# EAGLE design ArduinoRgbFanController (EAGLE 7.4.0)
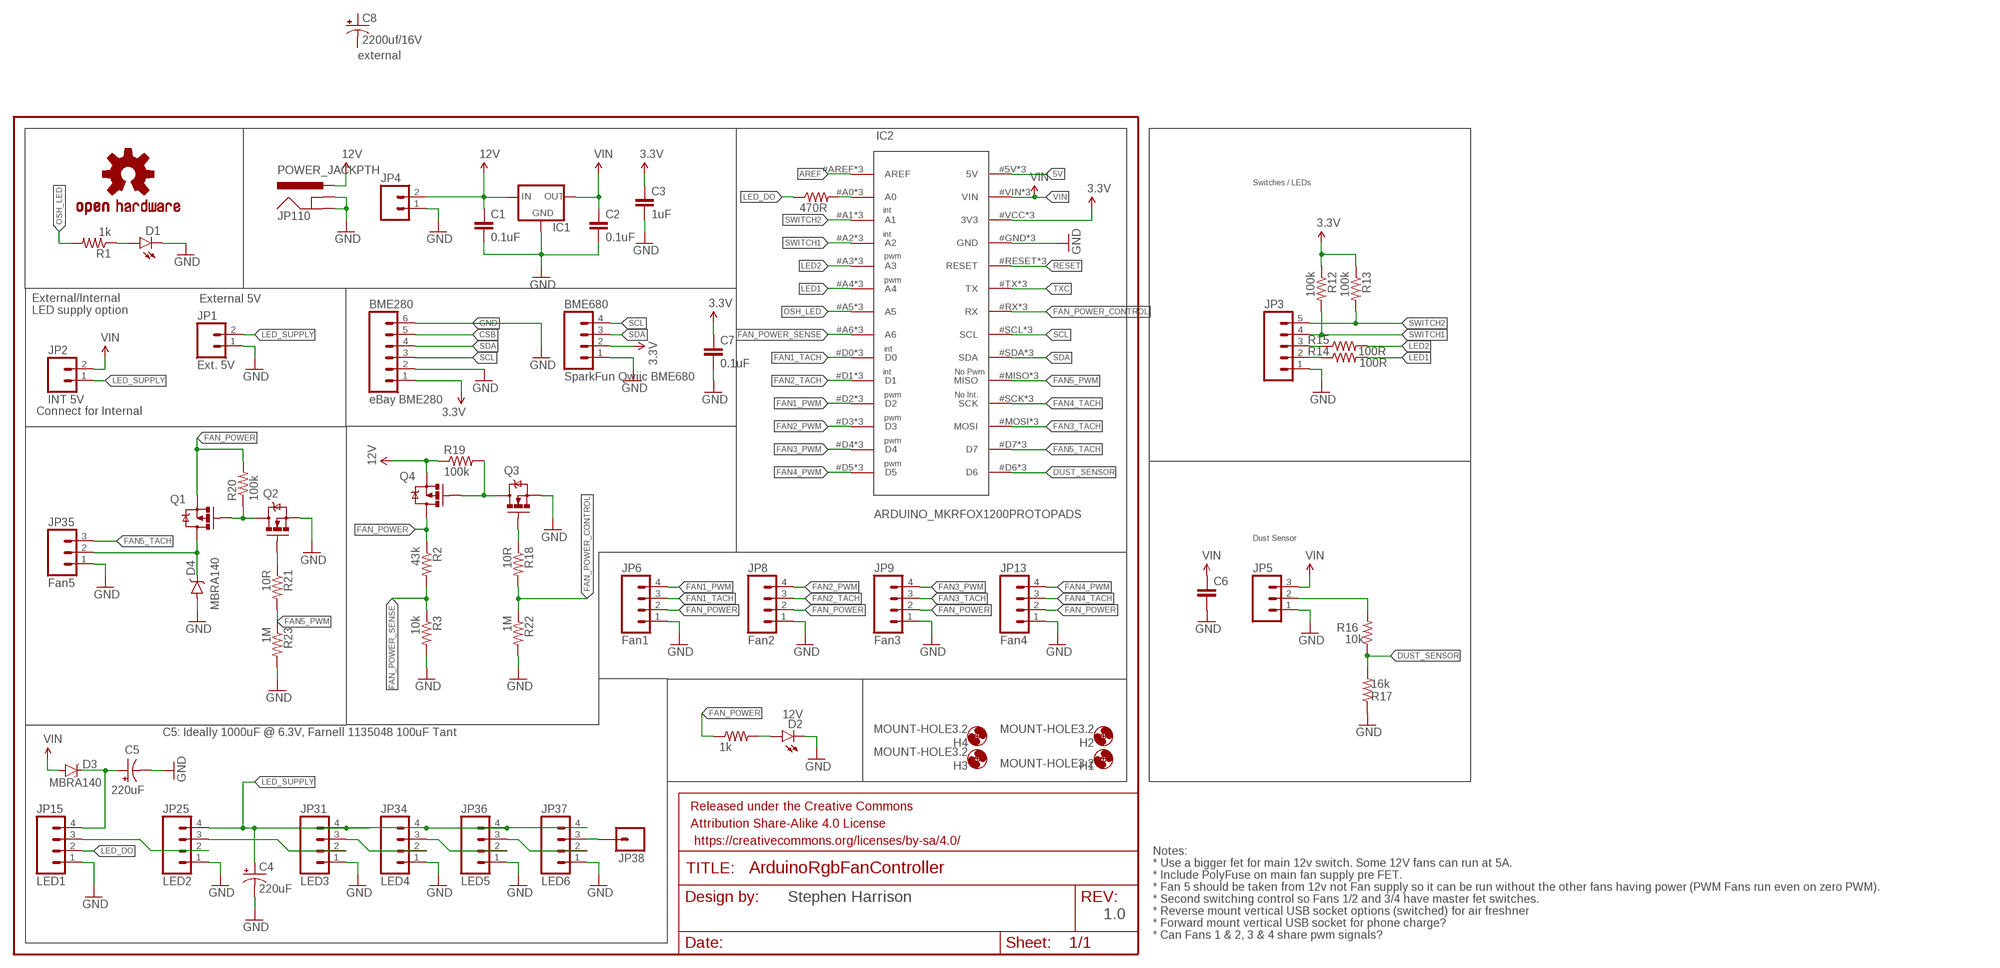
[diagram p0: schematic, sheet 1]

## Parts
BME280  eBay BME280  M06SILK_FEMALE_PTH  [1X06]
BME680  SparkFun Qwiic BME680  M04PTH  [1X04]
C1  0.1uF  1UF-25V-10%(0805)"  [0805-CAP]
C2  0.1uF  1UF-25V-10%(0805)"  [0805-CAP]
C3  1uF  1UF-25V-10%(0805)"  [0805-CAP]
C4  220uF  47UF-10V-10%(TANT)  [EIA3528]
C5  220uF  47UF-10V-10%(TANT)  [EIA3528]
C6  1UF-25V-10%(0805)"  [0805-CAP]
C7  0.1uF  1UF-25V-10%(0805)"  [0805-CAP]
C8  2200uf/16V  1000UF-25V(PTH)KIT  [CPOL-RADIAL-1000UF-25V-KIT]
D1  LED1206-BOTTOM  [LED-1206-BOTTOM]
D2  12V  LED-RED1206  [LED-1206]
D3  MBRA140  DIODE-SCHOTTKY-MBRA140  [SMA-DIODE]
D4  MBRA140  DIODE-SCHOTTKY-MBRA140  [SMA-DIODE]
FRAME1  FRAME-LETTER  [CREATIVE_COMMONS]
H1  MOUNT-HOLE3.2  [3,2]
H2  MOUNT-HOLE3.2  [3,2]
H3  MOUNT-HOLE3.2  [3,2]
H4  MOUNT-HOLE3.2  [3,2]
IC1  78XXS  [78XXS]
IC2  ARDUINO_MKRFOX1200PROTOPADS  [ARDUINO_MKRFOX1200_PROTOPADS]
JP1  Ext. 5V  M023.5MM  [SCREWTERMINAL-3.5MM-2]
JP2  INT 5V  M02PTH  [1X02]
JP3  M05PTH  [1X05]
JP4  M025MM  [SCREWTERMINAL-5MM-2]
JP5  M03POLAR  [MOLEX-1X3]
JP6  Fan1  M04POLAR  [MOLEX-1X4]
JP8  Fan2  M04POLAR  [MOLEX-1X4]
JP9  Fan3  M04POLAR  [MOLEX-1X4]
JP13  Fan4  M04POLAR  [MOLEX-1X4]
JP15  LED1  M04PTH  [1X04]
JP25  LED2  M04PTH  [1X04]
JP31  LED3  M04PTH  [1X04]
JP34  LED4  M04PTH  [1X04]
JP35  Fan5  M03POLAR  [MOLEX-1X3]
JP36  LED5  M04PTH  [1X04]
JP37  LED6  M04PTH  [1X04]
JP38  M01PTH  [1X01]
JP110  POWER_JACKPTH  [POWER_JACK_PTH]
LOGO3  OSHW-LOGOM  [OSHW-LOGO-M]
Q1  IRLML930  MOSFET-PCHANNEL  [SOT23-3]
Q2  2N7002  MOSFET-NCHANNELAO3404A  [SOT23-3]
Q3  2N7002  MOSFET-NCHANNELAO3404A  [SOT23-3]
Q4  IRLML930  MOSFET-PCHANNEL  [SOT23-3]
R1  1k  RESISTOR0805-RES  [0805]
R2  43k  RESISTOR0805-RES  [0805]
R3  10k  RESISTOR0805-RES  [0805]
R11  470R  RESISTOR0805-RES  [0805]
R12  100k  RESISTOR0805-RES  [0805]
R13  100k  RESISTOR0805-RES  [0805]
R14  100R  RESISTOR0805-RES  [0805]
R15  100R  RESISTOR0805-RES  [0805]
R16  10k  RESISTOR0805-RES  [0805]
R17  16k  RESISTOR0805-RES  [0805]
R18  10R  RESISTOR0805-RES  [0805]
R19  100k  RESISTOR0805-RES  [0805]
R20  100k  RESISTOR0805-RES  [0805]
R21  10R  RESISTOR0805-RES  [0805]
R22  1M  RESISTOR0805-RES  [0805]
R23  1M  RESISTOR0805-RES  [0805]
R28  1k  RESISTOR1206  [1206]

## Nets
3.3V: BME280.1 BME680.2 C3.1 C7.1 IC2.#VCC(3V3) IC2.@VCC(3V3) IC2.VCC(3V3) R12.1 R13.1
5V: IC2.5V IC2.#5V(5V) IC2.@5V(5V)
12V: C1.1 IC1.IN JP4.2 JP110.PWR Q4.2(S) R19.1
AREF: IC2.#AREF(AREF) IC2.@AREF(AREF) IC2.AREF
CSB: BME280.5
DUST_SENSOR: IC2.#D6(D6) IC2.@D6(D6) IC2.D6 R16.1 R17.2
FAN1_PWM: IC2.#D2(D2) IC2.@D2(D2) IC2.D2 JP6.4
FAN1_TACH: IC2.#D0(D0) IC2.@D0(D0) IC2.D0 JP6.3
FAN2_PWM: IC2.#D3(D3) IC2.@D3(D3) IC2.D3 JP8.4
FAN2_TACH: IC2.#D1(D1) IC2.@D1(D1) IC2.D1 JP8.3
FAN3_PWM: IC2.#D4(D4) IC2.@D4(D4) IC2.D4 JP9.4
FAN3_TACH: IC2.#MOSI(MOSI) IC2.@MOSI(MOSI) IC2.MOSI JP9.3
FAN4_PWM: IC2.#D5(D5) IC2.@D5(D5) IC2.D5 JP13.4
FAN4_TACH: IC2.#SCK(SCK) IC2.@SCK(SCK) IC2.SCK JP13.3
FAN5_PWM: IC2.#MISO(MISO) IC2.@MISO(MISO) IC2.MISO R21.2 R23.1
FAN5_TACH: IC2.#D7(D7) IC2.@D7(D7) IC2.D7 JP35.3
FAN_POWER: JP6.2 JP8.2 JP9.2 JP13.2 Q1.2(S) Q4.3(D) R2.1 R20.2 R28.1
FAN_POWER_CONTROL: IC2.#RX(RX) IC2.@RX(RX) IC2.RX R18.2 R22.1
FAN_POWER_SENSE: IC2.#A6(A6) IC2.@A6(A6) IC2.A6 R2.2 R3.1
GND: BME280.2 BME280.6 BME680.1 C1.2 C2.2 C3.2 C4.C(-) C5.C(-) C6.2 C7.2 D1.C D2.C D4.A IC1.GND IC2.#GND(GND) IC2.@GND(GND) IC2.GND JP1.1 JP3.1 JP4.1 JP5.1 JP6.1 JP8.1 JP9.1 JP13.1 JP15.1 JP25.1 JP31.1 JP34.1 JP35.1 JP36.1 JP37.1 JP110.GND JP110.GNDBREAK Q2.2(S) Q3.2(S) R3.2 R17.1 R22.2 R23.2
LED1: IC2.#A4(A4) IC2.@A4(A4) IC2.A4 R14.2
LED2: IC2.#A3(A3) IC2.@A3(A3) IC2.A3 R15.2
LED_DO: JP15.2 R11.1
LED_SUPPLY: C4.A(+) JP1.2 JP2.1 JP25.4 JP31.4 JP34.4 JP36.4 JP37.4
N$1: D1.A R1.1
N$2: IC2.#A0(A0) IC2.@A0(A0) IC2.A0 R11.2
N$3: JP3.2 R14.1
N$4: JP3.3 R15.1
N$5: Q3.3(D) Q4.1(G) R19.2
N$6: Q3.1(G) R18.1
N$7: JP5.2 R16.2
N$12: D4.C JP35.2 Q1.3(D)
N$16: C5.A(+) D3.C JP15.4
N$17: JP25.3 JP31.2
N$18: JP31.3 JP34.2
N$20: JP34.3 JP36.2
N$21: JP36.3 JP37.2
N$24: JP37.3 JP38.1
N$28: Q1.1(G) Q2.3(D) R20.1
N$30: JP15.3 JP25.2
N$32: Q2.1(G) R21.1
N$94: D2.A R28.2
OSH_LED: IC2.#A5(A5) IC2.@A5(A5) IC2.A5 R1.2
RESET: IC2.#RESET(RESET) IC2.@RESET(RESET) IC2.RESET
SCL: BME280.3 BME680.4 IC2.#SCL(SCL) IC2.@SCL(SCL) IC2.SCL
SDA: BME280.4 BME680.3 IC2.#SDA(SDA) IC2.@SDA(SDA) IC2.SDA
SWITCH1: IC2.#A2(A2) IC2.@A2(A2) IC2.A2 JP3.4 R12.2
SWITCH2: IC2.#A1(A1) IC2.@A1(A1) IC2.A1 JP3.5 R13.2
TXC: IC2.#TX(TX) IC2.@TX(TX) IC2.TX
VIN: C2.1 C6.1 D3.A IC1.OUT IC2.#VIN(VIN) IC2.@VIN(VIN) IC2.VIN JP2.2 JP5.3
Unconnected: C8.+ C8.-

## Notes on the sheet
- external
- Switches / LEDs
- int
- int
- pwm
- pwm
- External 5V
- External/Internal 
  LED supply option
- int
- int | No Pwm
- pwm | No Int.
- Connect for Internal
- pwm
- pwm
- pwm
- Dust Sensor
- C5: Ideally 1000uF @ 6.3V, Farnell 1135048 100uF Tant
- Stephen Harrison
- 1.0
- Notes:
  * Use a bigger fet for main 12v switch. Some 12V fans can run at 5A.
  * Include PolyFuse on main fan supply pre FET.
  * Fan 5 should be taken from 12v not Fan supply so it can be run without the other fans having power (PWM Fans run even on zero PWM).
  * Second switching control so Fans 1/2 and 3/4 have master fet switches.
  * Reverse mount vertical USB socket options (switched) for air freshner
  * Forward mount vertical USB socket for phone charge?
  * Can Fans 1 & 2, 3 & 4 share pwm signals?

## Library data of the parts
BME280 = SparkFun-Connectors:M06: Header 6 Standard 6-pin 0.1" header. Use with straight break away headers (SKU : PRT-00116), right angle break away headers (PRT-00553), swiss pins (PRT-00743), machine pins (PRT-00117), and female headers (PRT-00115). Molex polarized connector foot print use with SKU : PRT-08094 with associated crimp pins and housings. NOTES ON THE VARIANTS LOCK and LOCK_LONGPADS... This footprint was designed to help hold the alignment of a through-hole component (i.e. 6-pin header) while soldering it into place. You may notice that each hole has been shifted either up or down by 0.005 of an inch from it's more standard position (which is a perfectly straight line). This slight alteration caused the pins (the squares in the middle) to touch the edges of the holes. Because they are alternating, it causes a "brace" to hold the component in place. 0.005 has proven to be the perfect amount of "off-center" position when using our standard breakaway headers. Although looks a little odd when you look at the bare footprint, once you have a header in there, the alteration is very hard to notice. Also,if you push a header all the way into place, it is covered up entirely on the bottom side. This idea of altering the position of holes to aid alignment will be further integrated into the Sparkfun Library for other footprints. It can help hold any component with 3 or more connection pins.; PROD_ID: CONN-08437
BME680 JP8 JP9 JP13 = SparkFun-Connectors:M04: Header 4 Standard 4-pin 0.1" header. Use with straight break away headers (SKU : PRT-00116), right angle break away headers (PRT-00553), swiss pins (PRT-00743), machine pins (PRT-00117), and female headers (PRT-00115). Molex polarized connector foot print use with SKU : PRT-08231 with associated crimp pins and housings. 1MM SMD Version SKU: PRT-10208
C1-C3 C6 C7 = SparkFun-Capacitors:1UF-25V-10%(0805): CAP-08064
C4 C5 = SparkFun-Capacitors:47UF-10V-10%(TANT): CAP-08310 47uF Tantalum SMT 10V 10% (EIA-3528); FARNELL: 2491486; PROD_ID: CAP-08310; VALUE: 47uF
C8 = SparkFun-Capacitors:1000UF-25V(PTH): CAP-08070; PROD_ID: CAP-09538; VALUE: 1000uf/25V
D1 = SparkFun-LED:LED: LEDs Standard schematic elements and footprints for 5mm, 3mm, 1206, and 0603 sized LEDs. 5mm - Spark Fun Electronics SKU : COM-00529 (and others)
D2 = SparkFun-LED:LED-RED: Assorted Red LEDs LilyPad 1206- DIO-09912 1206- DIO-00809 0603- DIO-00819 "SMART" means more efficient and expensive; PROD_ID: DIO-09912; VALUE: RED
D3 D4 = SparkFun-DiscreteSemi:DIODE-SCHOTTKY: Schottky diodes in SFE's production catalog BAT20J 1A 23V 0.62Vf RB751 120mA 40V 0.37Vf PMEG4005EJ 0.5A 40V 0.42Vf MBRA140 1A 40V 0.5Vf B340A 3A 40V SMA; PROD_ID: DIO-08053
FRAME1 = SparkFun-Aesthetics:FRAME-LETTER: Schematic Frame Standard 8.5x11 US Letter frame
H1-H4 = holes:MOUNT-HOLE: MOUNTING HOLE with drill center marker
IC1 = v-reg:78XXS: VOLTAGE REGULATOR
IC2 = Arduino:ARDUINO_MKRFOX1200
JP1 = SparkFun-Connectors:M02: Standard 2-pin 0.1" header. Use with - straight break away headers ( PRT-00116) - right angle break away headers (PRT-00553) - swiss pins (PRT-00743) - machine pins (PRT-00117) - female headers (PRT-00115) Molex polarized connector foot print use with: PRT-08233 with associated crimp pins and housings. 2.54_SCREWTERM for use with PRT-10571. 3.5mm Screw Terminal footprints for PRT-08084 5mm Screw Terminal footprints for use with PRT-08432; PROD_ID: CONN-08399
JP2 = SparkFun-Connectors:M02: Standard 2-pin 0.1" header. Use with - straight break away headers ( PRT-00116) - right angle break away headers (PRT-00553) - swiss pins (PRT-00743) - machine pins (PRT-00117) - female headers (PRT-00115) Molex polarized connector foot print use with: PRT-08233 with associated crimp pins and housings. 2.54_SCREWTERM for use with PRT-10571. 3.5mm Screw Terminal footprints for PRT-08084 5mm Screw Terminal footprints for use with PRT-08432
JP3 = SparkFun-Connectors:M05: Header 5 Standard 5-pin 0.1" header. Use with straight break away headers (SKU : PRT-00116), right angle break away headers (PRT-00553), swiss pins (PRT-00743), machine pins (PRT-00117), and female headers (PRT-00115). Molex polarized connector foot print use with SKU : PRT-08230 with associated crimp pins and housings.
JP4 = SparkFun-Connectors:M02: Standard 2-pin 0.1" header. Use with - straight break away headers ( PRT-00116) - right angle break away headers (PRT-00553) - swiss pins (PRT-00743) - machine pins (PRT-00117) - female headers (PRT-00115) Molex polarized connector foot print use with: PRT-08233 with associated crimp pins and housings. 2.54_SCREWTERM for use with PRT-10571. 3.5mm Screw Terminal footprints for PRT-08084 5mm Screw Terminal footprints for use with PRT-08432; STOREFRONT_ID: PRT-08432
JP5 JP35 = SparkFun-Connectors:M03: Header 3 Standard 3-pin 0.1" header. Use with straight break away headers (SKU : PRT-00116), right angle break away headers (PRT-00553), swiss pins (PRT-00743), machine pins (PRT-00117), and female headers (PRT-00115). Molex polarized connector foot print use with SKU : PRT-08232 with associated crimp pins and housings.
JP6 = SparkFun-Connectors:M04: Header 4 Standard 4-pin 0.1" header. Use with straight break away headers (SKU : PRT-00116), right angle break away headers (PRT-00553), swiss pins (PRT-00743), machine pins (PRT-00117), and female headers (PRT-00115). Molex polarized connector foot print use with SKU : PRT-08231 with associated crimp pins and housings. 1MM SMD Version SKU: PRT-10208; FARNELL: 2313705; MOLEX: 47053-1000
JP15 JP25 JP31 JP34 JP36 JP37 = SparkFun-Connectors:M04: Header 4 Standard 4-pin 0.1" header. Use with straight break away headers (SKU : PRT-00116), right angle break away headers (PRT-00553), swiss pins (PRT-00743), machine pins (PRT-00117), and female headers (PRT-00115). Molex polarized connector foot print use with SKU : PRT-08231 with associated crimp pins and housings. 1MM SMD Version SKU: PRT-10208; FARNELL: 2063775
JP38 = SparkFun-Connectors:M01: Header 1 Standard 1-pin 0.1" header. Use with straight break away headers (SKU : PRT-00116), right angle break away headers (PRT-00553), swiss pins (PRT-00743), machine pins (PRT-00117), and female headers (PRT-00115).
JP110 = SparkFun-Connectors:POWER_JACK: Power Jack This is the standard 5.5mm barrel jack for power. The PTH is the most common, proven, reliable, footprint. The Slot footprint only works if the mill layer is transmitted to the PCB fab house so be warned. Mating wall wart : TOL-00298 (and others); PROD_ID: CONN-08197
LOGO3 = SparkFun-Aesthetics:OSHW-LOGO: Open Source Hardware Logo This logo indicates the piece of hardware it is found on incorporates a OSHW license and/or adheres to the definition of open source hardware found here: http://freedomdefined.org/OSHW
Q1 Q4 = SparkFun-DiscreteSemi:MOSFET-PCHANNEL: Generic PMOSFET IRLML2244 - TRANS-11153 (SOT-23 -20V -4.3A) (1.Gate 2.Source 3.Drain) FQP27P06 - COM-10349 <http://www.sparkfun.com/products/10349> (TO-220 -60V -27A) (1.Gate 2.Source 3.Drain); FARNELL: 1831089; PROD_ID: TRANS-08285
Q2 Q3 = SparkFun-DiscreteSemi:MOSFET-NCHANNEL: Common NMOSFET Parts MFG P/N Store ID Prod ID FDD8780 TRANS-09984 SI7820DN TRANS-11055 FDS6630A IC-08089 2N7002PW TRANS-11151 FQP30N06L COM-10213 TRANS-10060 BSS123LT1G TRANS-08345 BSS138 TRANS-00830 BS170 2N7000; FARNELL: 1510761; PROD_ID: TRAN-12988
R1-R3 R11-R23 R28 = SparkFun-Resistors:RESISTOR: Resistor Basic schematic elements and footprints for 0603, 1206, and PTH resistors.

## Board
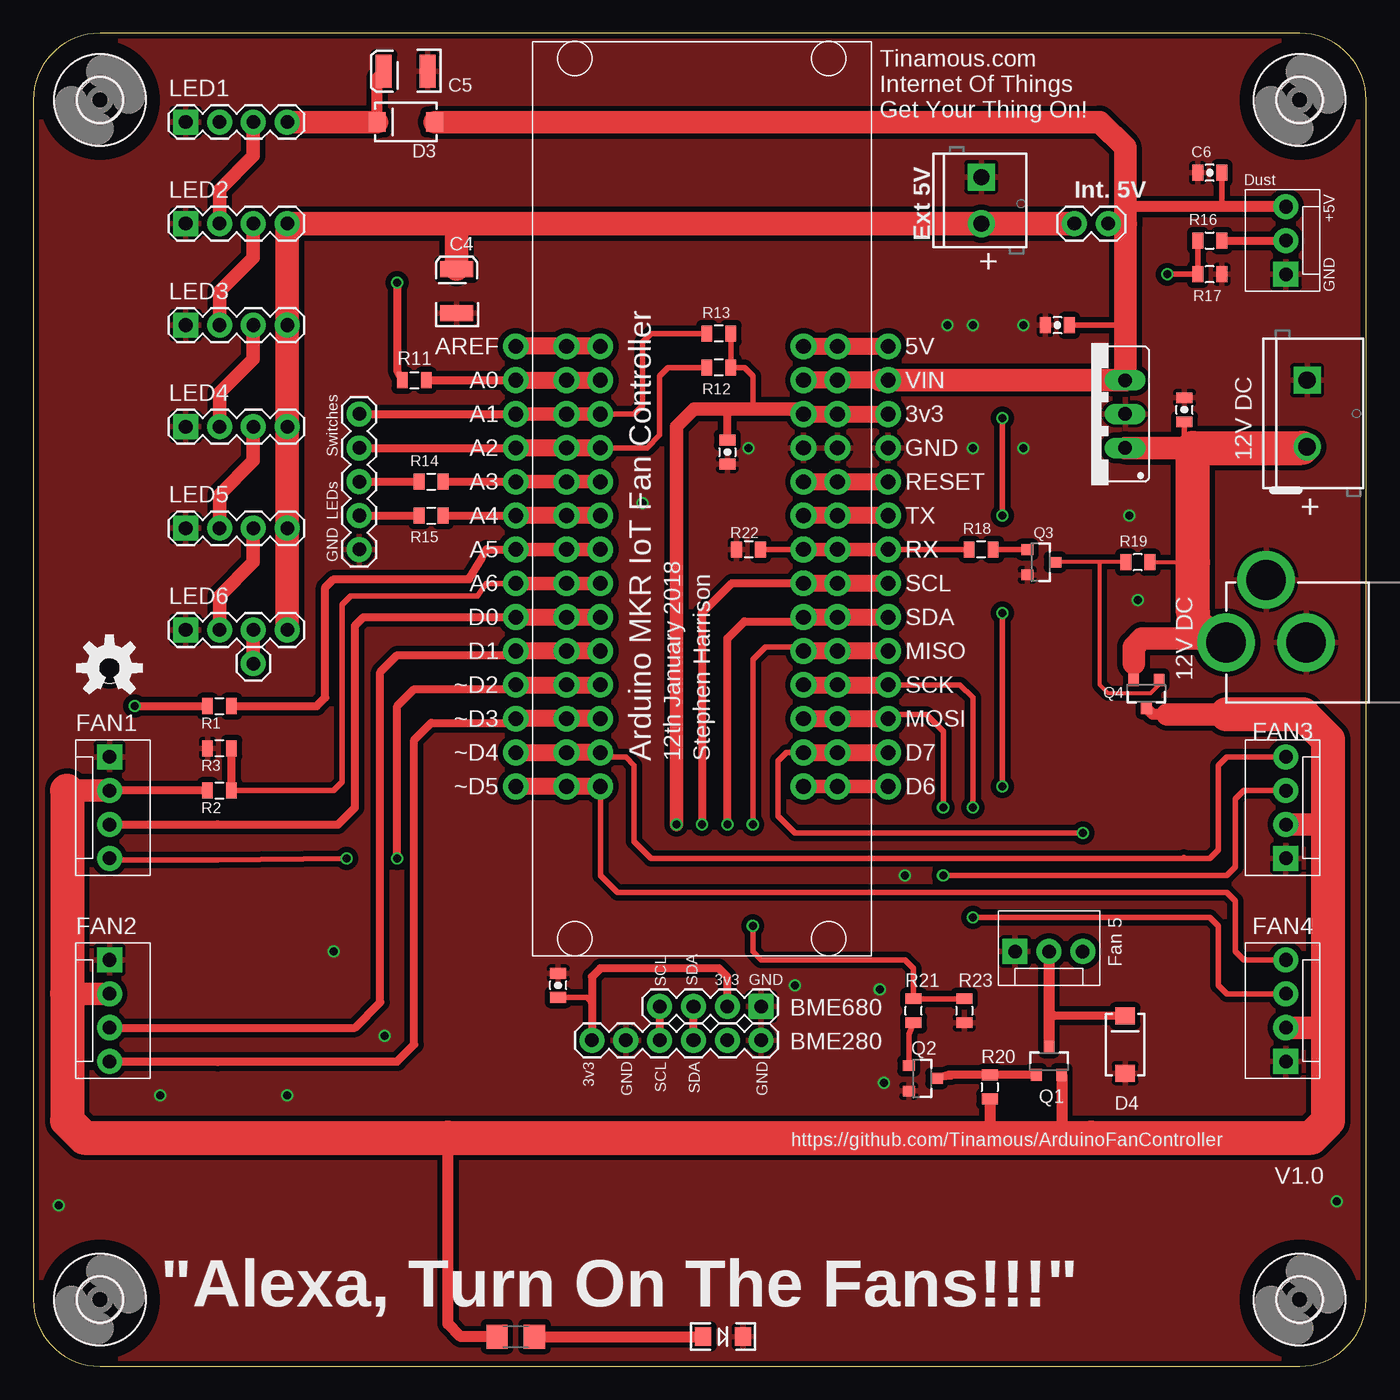
[diagram p1: board, top side]
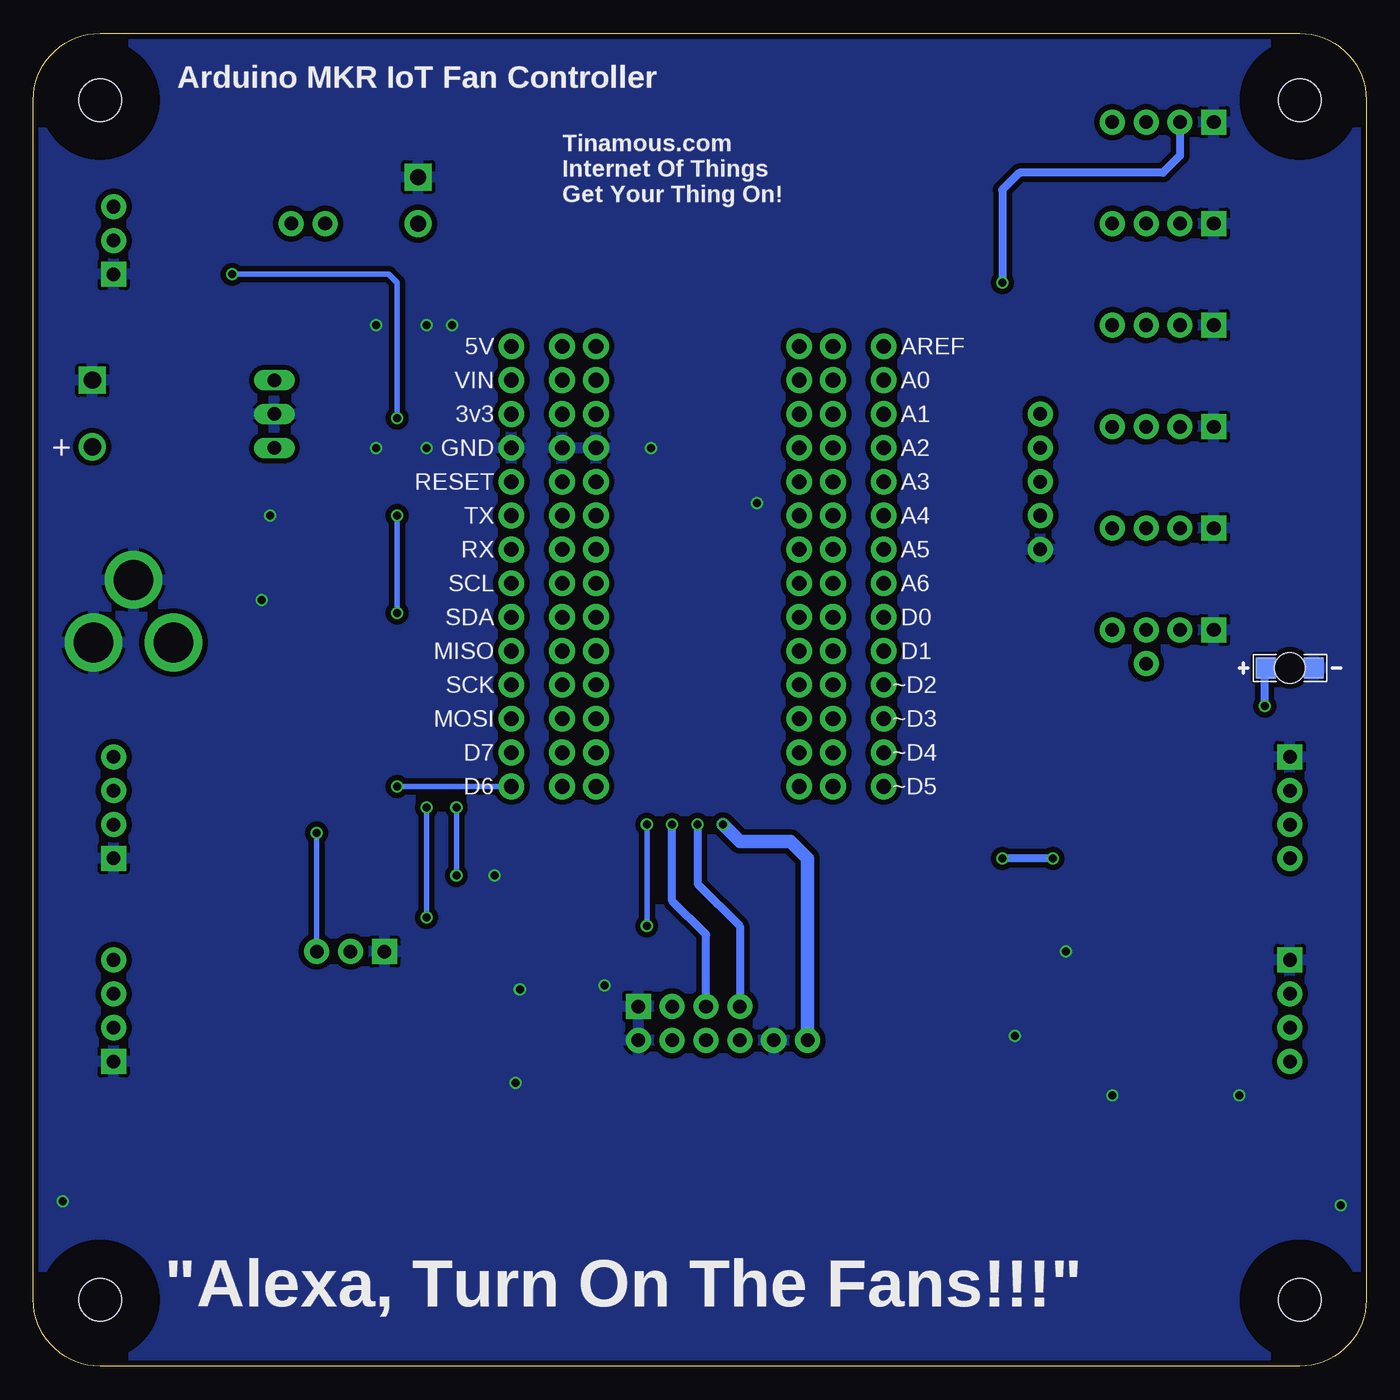
[diagram p2: board, bottom side, seen from below]

Size 100 x 100 mm. Coordinates in mm from the lower left corner, seen from the top.
Outline: 5,0 95,0 arc90 100,5 100,95 arc90 95,100 5,100 arc90 0,95 0,5 arc90 5,0
Copper layers (1*16): Top 0.035mm / dielectric 1.5mm / Bottom 0.035mm
Design rules "dirt_cheap_dirty_boards.v1": minimum track width 5mil, minimum drill 12mil, track to track 5mil, track to pad 5mil, pad to pad 5mil, via to via 5mil, smd to smd 0mil, copper to edge 10mil, drill to drill 10mil, minimum pad ring 10mil, minimum via ring 6mil, stop-mask expansion 2mil, vias tented up to drill 25mil, thermal gap 10mil

### Footprints (pad centres in the part's own frame; a part is rotated, then mirrored left to right if it is on the bottom)
1X06 = drill 1.016 pad 1.88: 1 0,0; 2 2.54,0; 3 5.08,0; 4 7.62,0; 5 10.16,0; 6 12.7,0
1X04 = drill 1.016 pad 1.88 square: 1 0,0 | drill 1.016 pad 1.88: 2 2.54,0; 3 5.08,0; 4 7.62,0
0805-CAP = smd 0.8 x 1.2: 1 -0.9,0; 2 0.9,0
EIA3528 = smd 1.2 x 2.5: A 1.65,0; C -1.65,0
CPOL-RADIAL-1000UF-25V-KIT = drill 0.9 pad 1.93 square: + 2.5,0 | drill 0.9 pad 1.93: - -2.5,0
LED-1206-BOTTOM = smd 1.5 x 1.6: A -1.8,0; C 1.8,0 | hole 2.3: 0,0
LED-1206 = smd 1.2 x 1.4: A -1.5,0; C 1.5,0
SMA-DIODE = smd 1.27 x 1.47: A -2.15,0; C 2.15,0
3,2 = hole 3.2: 0,0
78XXS = drill 1.016 long: GND 0,-2.54; IN -2.54,-2.54; OUT 2.54,-2.54
ARDUINO_MKRFOX1200_PROTOPADS = drill 1.1 pad 1.93: 5V 22.86,45.72; #5V 20.32,45.72; #A0 5.08,43.18; #A1 5.08,40.64; #A2 5.08,38.1; #A3 5.08,35.56; #A4 5.08,33.02; #A5 5.08,30.48; #A6 5.08,27.94; #AREF 5.08,45.72; #D0 5.08,25.4; #D1 5.08,22.86; #D2 5.08,20.32; #D3 5.08,17.78; #D4 5.08,15.24; #D5 5.08,12.7; #D6 20.32,12.7; #D7 20.32,15.24; #GND 20.32,38.1; #MISO 20.32,22.86; #MOSI 20.32,17.78; #RESET 20.32,35.56; #RX 20.32,30.48; #SCK 20.32,20.32; #SCL 20.32,27.94; #SDA 20.32,25.4; #TX 20.32,33.02; #VCC 20.32,40.64; #VIN 20.32,43.18; @5V 26.67,45.72; @A0 -1.27,43.18; @A1 -1.27,40.64; @A2 -1.27,38.1; @A3 -1.27,35.56; @A4 -1.27,33.02; @A5 -1.27,30.48; @A6 -1.27,27.94; @AREF -1.27,45.72; @D0 -1.27,25.4; @D1 -1.27,22.86; @D2 -1.27,20.32; @D3 -1.27,17.78; @D4 -1.27,15.24; @D5 -1.27,12.7; @D6 26.67,12.7; @D7 26.67,15.24; @GND 26.67,38.1; @MISO 26.67,22.86; @MOSI 26.67,17.78; @RESET 26.67,35.56; @RX 26.67,30.48; @SCK 26.67,20.32; @SCL 26.67,27.94; @SDA 26.67,25.4; @TX 26.67,33.02; @VCC 26.67,40.64; @VIN 26.67,43.18; A0 2.54,43.18; A1 2.54,40.64; A2 2.54,38.1; A3 2.54,35.56; A4 2.54,33.02; A5 2.54,30.48; A6 2.54,27.94; AREF 2.54,45.72; D0 2.54,25.4; D1 2.54,22.86; D2 2.54,20.32; D3 2.54,17.78; D4 2.54,15.24; D5 2.54,12.7; D6 22.86,12.7; D7 22.86,15.24; GND 22.86,38.1; MISO 22.86,22.86; MOSI 22.86,17.78; RESET 22.86,35.56; RX 22.86,30.48; SCK 22.86,20.32; SCL 22.86,27.94; SDA 22.86,25.4; TX 22.86,33.02; VCC 22.86,40.64; VIN 22.86,43.18
SCREWTERMINAL-3.5MM-2 = drill 1.2 pad 2.032 square: 1 0,0 | drill 1.2 pad 2.032: 2 3.5,0
1X02 = drill 1.016 pad 1.88: 1 0,0; 2 2.54,0
1X05 = drill 1.016 pad 1.88: 1 0,0; 2 2.54,0; 3 5.08,0; 4 7.62,0; 5 10.16,0
SCREWTERMINAL-5MM-2 = drill 1.3 pad 2.032 square: 1 0,0 | drill 1.3 pad 2.032: 2 5,0
MOLEX-1X3 = drill 1.016 pad 1.88 square: 1 0,0 | drill 1.016 pad 1.88: 2 2.54,0; 3 5.08,0
MOLEX-1X4 = drill 1.016 pad 1.88 square: 1 0,0 | drill 1.016 pad 1.88: 2 2.54,0; 3 5.08,0; 4 7.62,0
1X01 = drill 1.016 pad 1.88: 1 0,0
POWER_JACK_PTH = drill 2.997 pad 4.318: GND 0,7.7; GNDBREAK 4.7,10.7; PWR 0,13.7
SOT23-3 = smd 0.8 x 0.9: 1 -0.95,-1; 2 0.95,-1; 3 0,1.1
0805 = smd 0.8 x 1.2: 1 -0.9,0; 2 0.9,0
1206 = smd 1.6 x 1.8: 1 -1.4,0; 2 1.4,0

### Placement (x,y rotation side)
BME280  41.91,24.45 0 top
BME680  54.61,26.99 180 top
C1  86.36,71.75 90 top
C2  76.83,78.11 180 top
C3  52.07,68.58 270 top
C4  31.75,80.64 90 top
C5  27.94,97.16 180 top
C6  88.27,89.53 180 top
C7  39.37,28.57 90 top
C8  -8.5,-20.4 0 top  (outside the outline)
D1  5.71,52.39 0 bottom
D2  51.75,2.22 0 top
D3  27.94,93.34 180 top
D4  81.92,24.13 90 top
FRAME1  17.09,-13.32 0 top  (outside the outline)
H1  5,5 0 top
H2  5,95 0 top
H3  95,95 0 top
H4  95,5 0 top
IC1  79.38,71.44 90 top
IC2  37.47,30.8 0 top
JP1  71.12,89.22 270 top
JP2  78.11,85.72 0 top
JP3  24.45,61.28 90 top
JP4  95.57,73.98 270 top
JP5  93.98,81.92 90 top
JP6  5.71,45.72 270 top
JP8  5.71,30.48 270 top
JP9  93.98,38.1 90 top
JP13  93.98,22.86 90 top
JP15  11.43,93.34 0 top
JP25  11.43,85.72 0 top
JP31  11.43,78.11 0 top
JP34  11.43,70.48 0 top
JP35  73.66,31.11 0 top
JP36  11.43,62.87 0 top
JP37  11.43,55.24 0 top
JP38  16.51,52.7 270 top
JP110  103.19,54.29 90 top
LOGO3  5.71,52.39 0 top
Q1  76.2,22.86 0 top
Q2  66.67,21.59 270 top
Q3  75.56,60.33 270 top
Q4  83.5,50.48 180 top
R1  13.97,49.53 0 top
R2  13.97,43.18 0 top
R3  13.97,46.35 180 top
R11  28.57,73.98 0 top
R12  51.44,74.93 180 top
R13  51.44,77.47 180 top
R14  29.84,63.82 0 top
R15  29.84,66.36 0 top
R16  88.27,84.45 0 top
R17  88.27,81.92 180 top
R18  71.12,61.28 180 top
R19  82.87,60.33 180 top
R20  71.75,20.95 270 top
R21  66.04,26.67 90 top
R22  53.66,61.28 180 top
R23  69.85,26.67 270 top
R28  36.2,2.22 0 top

### Tracks (layer width: path | path; a pad name or v marks a point on that pad's centre or on a via)
3.3V  (via drill 0.6)
  Top 0.406: 64.45,71.75 IC2.@VCC | R13.1 R12.1 53.34,74.93 53.98,74.3 53.98,71.81 | C7.1 41.54,27.68 41.91,27.3
  Top 0.61: BME680.2 52.07,29.21 51.44,29.84 42.55,29.84 41.91,29.21 41.91,27.3 BME280.1 | 52.02,71.86 52.07,71.81 C3.1
  Top 1.016: IC2.#VCC 57.41,71.81 53.98,71.81 52.07,71.81 49.58,71.81 48.26,70.48 v48.26,40.64
  Top 1.27: IC2.#VCC IC2.VCC IC2.@VCC
  Bottom 1.016: v48.26,40.64 46.99,39.37 43.18,39.37 41.91,38.1 BME280.1
5V
  Top 1.27: IC2.#5V IC2.5V IC2.@5V
12V
  Top 0.305: R19.1 87,60.33
  Top 0.406: C1.1 86.36,68.9
  Top 0.813: Q4.2 82.55,52.7
  Top 1.676: IC1.IN 86.36,68.9 87,68.9 | 95.17,68.9 JP4.2 | 87,55.88 87,56.52 | 89.53,54.24 JP110.PWR 89.17,54.61 83.19,54.61 82.55,53.98 82.55,52.7 | 88.58,53.98 88.9,54.29
  Top 2.54: 95.17,68.9 87,68.9 87,60.33 87,56.52 | JP110.PWR 88.9,54.29 88.58,54.29 87,55.88
  Bottom 1.016: 89.53,54.24 JP110.PWR
AREF
  Top 1.27: IC2.#AREF IC2.AREF IC2.@AREF
DUST_SENSOR  (via drill 0.6)
  Top 0.406: 64.45,43.18 IC2.@D6 | R16.1 R17.2 v85.09,81.92 | v72.71,43.5 v72.71,56.52 | v72.71,63.82 v72.71,71.12
  Top 1.016: IC2.#D6 IC2.D6 IC2.@D6
  Bottom 0.406: IC2.@D6 v72.71,43.5 | v72.71,56.52 v72.71,63.82 | v72.71,71.12 72.71,81.28 73.34,81.92 v85.09,81.92
FAN1_PWM  (via drill 0.6)
  Top 0.406: 35.88,50.8 IC2.@D2 | v23.5,38.1 13.84,37.97 5.84,37.97 JP6.4
  Top 0.61: v27.3,38.1 27.3,49.53 28.57,50.8 35.88,50.8
  Top 1.27: IC2.@D2 IC2.D2 IC2.#D2
  Bottom 0.61: v23.5,38.1 v27.3,38.1
FAN1_TACH
  Top 0.406: 35.88,56.2 IC2.@D0 | 13.84,40.77 13.97,40.64
  Top 0.61: JP6.3 13.97,40.64 22.86,40.64 24.13,41.91 24.13,55.56 24.77,56.2 35.88,56.2
  Top 1.27: IC2.@D0 IC2.D0 IC2.#D0
FAN2_PWM
  Top 0.406: 35.88,48.26 IC2.@D3 | 13.84,22.73 13.97,22.86
  Top 0.61: JP8.4 13.97,22.86 27.3,22.86 28.57,24.13 28.57,46.99 29.84,48.26 35.88,48.26
  Top 1.27: IC2.#D3 IC2.D3 IC2.@D3
FAN2_TACH
  Top 0.406: 35.88,53.34 IC2.@D1
  Top 0.61: JP8.3 24.13,25.4 26.04,27.3 26.04,52.07 27.3,53.34 35.88,53.34
  Top 1.27: IC2.#D1 IC2.D1 IC2.@D1
FAN3_PWM
  Top 0.406: 86.36,38.1 88.27,38.1 88.9,38.73 88.9,45.09 89.53,45.72 JP9.4 | 86.36,38.1 46.35,38.1 45.09,39.37 45.09,45.09 44.45,45.72 42.86,45.72 IC2.#D4 | 86.31,38.15 86.36,38.1
  Top 1.016: IC2.D4 40.32,46.04
  Top 1.27: IC2.#D4 IC2.D4 IC2.@D4
FAN3_TACH  (via drill 0.6)
  Top 0.406: 64.45,48.9 IC2.@MOSI | JP9.3 90.81,43.18 90.17,42.55 90.17,37.47 89.53,36.83 v68.26,36.83 | v68.26,41.91 68.26,47.62 66.99,48.9 57.47,48.9 IC2.#MOSI
  Top 1.27: IC2.#MOSI IC2.MOSI IC2.@MOSI
  Bottom 0.406: v68.26,36.83 v68.26,41.91
FAN4_PWM
  Top 0.406: IC2.#D5 42.55,36.83 43.81,35.56 89.53,35.56 90.17,34.92 90.17,31.11 90.81,30.48 JP13.4
  Top 1.27: IC2.#D5 IC2.D5 IC2.@D5
FAN4_TACH  (via drill 0.6)
  Top 0.406: JP13.3 89.53,27.94 88.9,28.57 88.9,33.02 88.27,33.66 v70.48,33.66 | v70.48,41.91 70.48,50.16 69.53,51.12 IC2.@SCK
  Top 1.27: IC2.#SCK IC2.SCK IC2.@SCK
  Bottom 0.406: v70.48,33.66 v70.48,41.91
FAN5_PWM  (via drill 0.6)
  Top 0.406: R23.1 R21.2 66.04,29.84 65.41,30.48 54.61,30.48 53.98,31.11 v53.98,33.02 | v53.98,40.64 53.98,53.02 54.93,53.98 57.47,53.98 IC2.#MISO
  Top 1.27: IC2.@MISO IC2.MISO IC2.#MISO
  Bottom 0.406: v53.98,40.64 v53.98,33.02
FAN5_TACH  (via drill 0.6)
  Top 0.406: v78.74,40.01 57.15,40.01 55.88,41.27 55.88,45.4 56.52,46.04 IC2.#D7
  Top 1.27: IC2.#D7 IC2.D7 IC2.@D7
  Bottom 0.406: JP35.3 v78.74,40.01
FAN_POWER
  Top 0.61: R2.1 JP6.2
  Top 0.813: Q1.2 77.16,17.46 79.38,17.14 | R20.2 71.75,17.14 | 85.09,48.9 83.99,48.9 Q4.3 | R28.1 32.07,2.22 31.11,3.17 31.11,17.14
  Top 1.676: JP6.2 2.54,43.18 | JP8.2 2.54,27.94 | JP13.2 97.16,25.4 | JP9.2 97.16,40.64 | 89.53,48.9 85.09,48.9
  Top 2.54: 2.54,43.18 2.54,27.94 2.54,18.41 3.81,17.14 31.11,17.14 71.75,17.14 79.38,17.14 95.89,17.14 97.16,18.41 97.16,25.4 97.16,40.64 97.16,46.99 95.25,48.9 89.53,48.9
FAN_POWER_CONTROL
  Top 0.406: R22.1 IC2.#RX | IC2.@RX R18.2
  Top 1.016: IC2.#RX IC2.RX IC2.@RX
FAN_POWER_SENSE
  Top 0.406: IC2.@A6 33.97,58.74 33.34,57.78 23.81,57.78 23.18,57.15 23.18,43.81 22.54,43.18 R2.2
  Top 0.61: R2.2 R3.1
  Top 1.016: IC2.#A6 IC2.A6 IC2.@A6
GND  (via drill 0.6)
  other vias: 19.05,20.32 57.15,28.57 22.54,31.11 26.35,24.77 9.53,20.32 68.58,78.11 74.3,78.11 70.48,78.11 63.82,21.27 63.5,28.26 1.91,12.06 97.79,12.38 70.48,68.9 53.66,68.9 82.23,63.82 82.87,57.47 45.72,64.77 65.41,36.83 74.3,68.9
  pour Bottom (isolate 0.406, rank 5): -0.64,100.33 100.33,100.33 100.33,-0.64 -0.64,-0.64
  pour Top (isolate 0.406, rank 6): 3.81,100.97 100.33,100.97 100.33,-0.64 -0.64,-0.64 -0.64,100.97
LED1
  Top 0.61: R14.2 IC2.@A4
  Top 1.27: IC2.#A4 IC2.A4 IC2.@A4
LED2
  Top 0.61: R15.2 IC2.@A3
  Top 1.016: IC2.#A3 IC2.A3 IC2.@A3
LED_DO  (via drill 0.6)
  Top 0.61: v27.3,81.28 27.3,74.67 R11.1
  Bottom 0.61: JP15.2 13.97,90.81 15.24,89.53 26.04,89.53 27.3,88.27 v27.3,81.28
LED_SUPPLY
  Top 1.778: 31.75,85.72 JP25.4 JP31.4 JP34.4 JP36.4 JP37.4 | 31.75,85.72 JP1.2 76.19,85.72 JP2.1 | C4.A 31.75,85.72
N$1  (via drill 0.6)
  Top 0.61: v7.62,49.53 R1.1
  Bottom 0.61: v7.62,49.53 7.62,52.28 D1.A
N$2
  Top 0.61: R11.2 IC2.@A0
  Top 1.27: IC2.@A0 IC2.A0 IC2.#A0
N$3
  Top 0.61: JP3.2 R14.1
N$4
  Top 0.61: JP3.3 R15.1
N$5
  Top 0.305: Q4.1 84.45,51.12 83.82,50.48 80.64,50.48 80.01,51.12 80.01,60.33 | 80.01,60.33 Q3.3 | R19.2 80.01,60.33
N$6
  Top 0.406: R18.1 Q3.1
N$7
  Top 0.61: R16.2 JP5.2
N$12
  Top 0.61: D4.C 76.59,26.28 76.2,26.67
  Top 0.813: JP35.2 76.2,26.67 Q1.3
N$16
  Top 0.813: D3.C 25.79,96.66 C5.A
  Top 1.676: D3.C JP15.4
N$17
  Top 1.016: JP31.2 13.97,80.64 16.51,83.19 JP25.3
N$18
  Top 1.016: JP34.2 13.97,73.03 16.51,75.56 JP31.3
N$20
  Top 1.016: JP36.2 13.97,65.41 16.51,67.94 JP34.3
N$21
  Top 1.016: JP37.2 13.97,57.78 16.51,60.33 JP36.3
N$24
  Top 1.016: JP37.3 JP38.1
N$28
  Top 0.406: 72.84,21.91 R20.1 | 68.88,21.72 Q2.3
  Top 0.61: Q1.1 72.39,21.86 | 72.39,21.86 R20.1 | 72.39,21.86 68.68,21.86 Q2.3
N$30
  Top 1.016: JP25.2 13.97,88.27 16.51,90.81 JP15.3
N$32
  Top 0.406: Q2.1 65.67,24.91 R21.1
N$94
  Top 0.813: R28.2 D2.A
OSH_LED
  Top 0.61: R1.2 21.27,49.53 21.91,50.16 21.91,58.42 22.54,59.05 32.7,59.05 33.66,60.64 33.97,61.28 IC2.@A5
  Top 1.016: IC2.@A5 IC2.A5 IC2.#A5
RESET
  Top 1.27: IC2.#RESET IC2.RESET IC2.@RESET
SCL  (via drill 0.6)
  Top 0.61: IC2.#SCL 52.39,58.74 50.16,56.52 v50.16,40.64 | BME680.4 BME280.3
  Top 1.27: IC2.@SCL IC2.SCL IC2.#SCL
  Bottom 0.61: v50.16,40.64 50.16,36.2 46.99,33.02 BME680.4
SDA  (via drill 0.6)
  Top 0.61: v52.07,40.64 52.07,54.61 53.34,55.88 57.47,55.88 IC2.#SDA | BME280.4 BME680.3
  Top 1.27: IC2.#SDA IC2.SDA IC2.@SDA
  Bottom 0.61: BME680.3 49.53,32.38 52.07,34.92 v52.07,40.64
SWITCH1
  Top 0.406: R12.2 47.62,74.93 46.99,74.3 46.99,69.85 46.04,68.9 IC2.#A2
  Top 0.61: JP3.4 IC2.@A2
  Top 1.27: IC2.#A2 IC2.A2 IC2.@A2
SWITCH2
  Top 0.406: R13.2 46.35,77.47 45.72,76.83 45.72,72.07 45.09,71.44 IC2.#A1
  Top 0.61: JP3.5 IC2.@A1
  Top 1.016: IC2.@A1 IC2.A1 IC2.#A1
TXC
  Top 1.27: IC2.@TX IC2.TX IC2.#TX
VIN
  Top 0.406: C2.1 81.92,78.11 | C6.1 89.17,87.36 89.53,87
  Top 0.813: JP5.3 89.53,87 81.92,87
  Top 1.016: IC2.@VIN 63.5,73.98
  Top 1.27: 63.5,73.98 IC2.VIN IC2.#VIN
  Top 1.676: 63.5,73.98 IC1.OUT 81.92,78.11 81.92,85.72 81.92,87 81.92,91.44 80.01,93.34 D3.A
  Top 1.778: JP2.2 81.92,85.72

### Text on the board
tNames: C5: Ideally 1000uF @ 6.3V | LED1 | Tinamous.com / Internet Of Things / Get Your Thing On! | Dust | LED2 | Int. 5V | +5V | Ext 5V | + | GND | LED3 | LED4 | Switches | 12V DC | LED5 | + | LEDs | GND | LED6 | 12V DC | FAN1 | FAN3 | Arduino MKR IoT Fan Controller | 12th January 2018 | Stephen Harrison | Fan 5 | FAN2 | FAN4 | SCL | SDA | 3v3 | GND | 3v3 | GND | SCL | SDA | GND | https://github.com/Tinamous/ArduinoFanController | V1.0 | "Alexa, Turn On The Fans!!!"
bNames: Arduino MKR IoT Fan Controller | Tinamous.com / Internet Of Things / Get Your Thing On! | + | "Alexa, Turn On The Fans!!!"
Document: Stephen Harrison